# EAGLE design Funkboard_v3 (EAGLE 6.1)
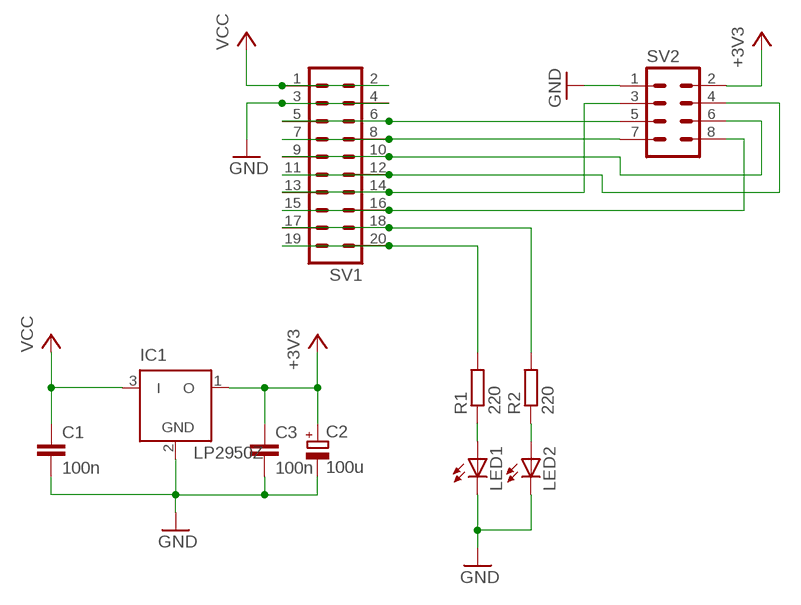
[diagram p0: schematic, sheet 1]

## Parts
C1  100n  C-EU025-025X050  [C025-025X050]
C2  100u  CPOL-EUE2.5-6  [E2,5-6]
C3  100n  C-EU025-025X050  [C025-025X050]
IC1  LP2950Z  [TO92]
LED1  LED3MM  [LED3MM]
LED2  LED3MM  [LED3MM]
R1  220  R-EU_0204/7  [0204/7]
R2  220  R-EU_0204/7  [0204/7]
SV1  MA10-2W  [MA10-2W]
SV2  MA04-2  [MA04-2]

## Nets
+3V3: C2.+ C3.1 IC1.1(O) SV2.2
GND: C1.2 C2.- C3.2 IC1.2(GND) LED1.K(C) LED2.K(C) SV1.3 SV1.4 SV2.1
N$1: LED1.A R1.1
N$2: LED2.A R2.1
N$3: SV1.5 SV1.6 SV2.5
N$4: SV1.7 SV1.8 SV2.7
N$5: SV1.9 SV1.10 SV2.6
N$6: SV1.11 SV1.12 SV2.4
N$7: SV1.13 SV1.14 SV2.3
N$8: SV1.15 SV1.16 SV2.8
N$9: R2.2 SV1.17 SV1.18
N$10: R1.2 SV1.19 SV1.20
VCC: C1.1 IC1.3(I) SV1.1 SV1.2

## Library data of the parts
C1 C3 = rcl:C-EU: CAPACITOR, European symbol
C2 = rcl:CPOL-EU: POLARIZED CAPACITOR, European symbol
IC1 = linear:LP2950: 100 mA, Low Power Low Dropout Voltage Regulator Source: http://www.onsemi.com/pub/Collateral/LP2950-D.PDF
LED1 LED2 = led:LED: LED OSRAM: - CHIPLED LG R971, LG N971, LY N971, LG Q971, LY Q971, LO R971, LY R971 LH N974, LH R974 LS Q976, LO Q976, LY Q976 LO Q996 - Hyper CHIPLED LW Q18S LB Q993, LB Q99A, LB R99A - SideLED LS A670, LO A670, LY A670, LG A670, LP A670 LB A673, LV A673, LT A673, LW A673 LH A674 LY A675 LS A676, LA A676, LO A676, LY A676, LW A676 LS A679, LY A679, LG A679 - Hyper Micro SIDELED® LS Y876, LA Y876, LO Y876, LY Y876 LT Y87S - SmartLED LW L88C, LW L88S LB L89C, LB L89S, LG L890 LS L89K, LO L89K, LY L89K LS L896, LA L896, LO L896, LY L896 - TOPLED LS T670, LO T670, LY T670, LG T670, LP T670 LSG T670, LSP T670, LSY T670, LOP T670, LYG T670 LG T671, LOG T671, LSG T671 LB T673, LV T673, LT T673, LW T673 LH T674 LS T676, LA T676, LO T676, LY T676, LB T676, LH T676, LSB T676, LW T676 LB T67C, LV T67C, LT T67C, LS T67K, LO T67K, LY T67K, LW E67C LS E67B, LA E67B, LO E67B, LY E67B, LB E67C, LV E67C, LT E67C LW T67C LS T679, LY T679, LG T679 LS T770, LO T770, LY T770, LG T770, LP T770 LB T773, LV T773, LT T773, LW T773 LH T774 LS E675, LA E675, LY E675, LS T675 LS T776, LA T776, LO T776, LY T776, LB T776 LHGB T686 LT T68C, LB T68C - Hyper Mini TOPLED® LB M676 - Mini TOPLED Santana® LG M470 LS M47K, LO M47K, LY M47K Source: http://www.osram.convergy.de LUXEON: - LUMILED® LXK2-PW12-R00, LXK2-PW12-S00, LXK2-PW14-U00, LXK2-PW14-V00 LXK2-PM12-R00, LXK2-PM12-S00, LXK2-PM14-U00 LXK2-PE12-Q00, LXK2-PE12-R00, LXK2-PE12-S00, LXK2-PE14-T00, LXK2-PE14-U00 LXK2-PB12-K00, LXK2-PB12-L00, LXK2-PB12-M00, LXK2-PB14-N00, LXK2-PB14-P00, LXK2-PB14-Q00 LXK2-PR12-L00, LXK2-PR12-M00, LXK2-PR14-Q00, LXK2-PR14-R00 LXK2-PD12-Q00, LXK2-PD12-R00, LXK2-PD12-S00 LXK2-PH12-R00, LXK2-PH12-S00 LXK2-PL12-P00, LXK2-PL12-Q00, LXK2-PL12-R00 Source: www.luxeon.com KINGBRIGHT: KA-3528ASYC Source: www.kingbright.com
R1 R2 = rcl:R-EU_: RESISTOR, European symbol
SV1 = con-lstb:MA10-2W: PIN HEADER; OC_FARNELL: unknown; OC_NEWARK: unknown
SV2 = con-lstb:MA04-2: PIN HEADER; OC_FARNELL: unknown; OC_NEWARK: unknown

## Board
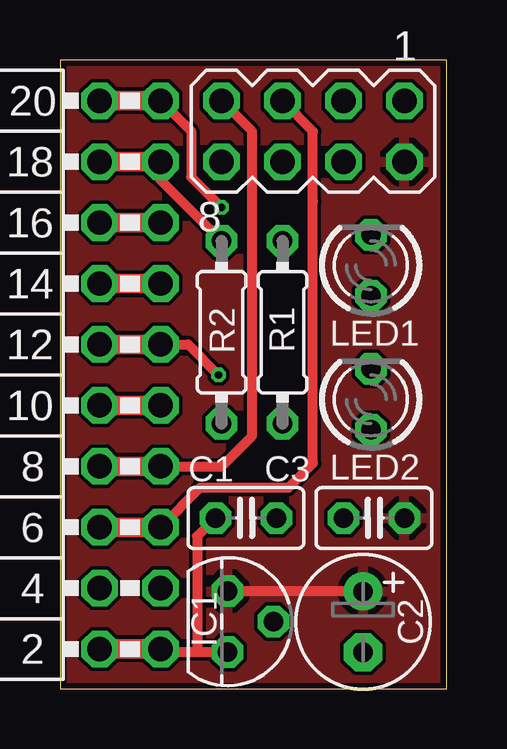
[diagram p1: board, top side]
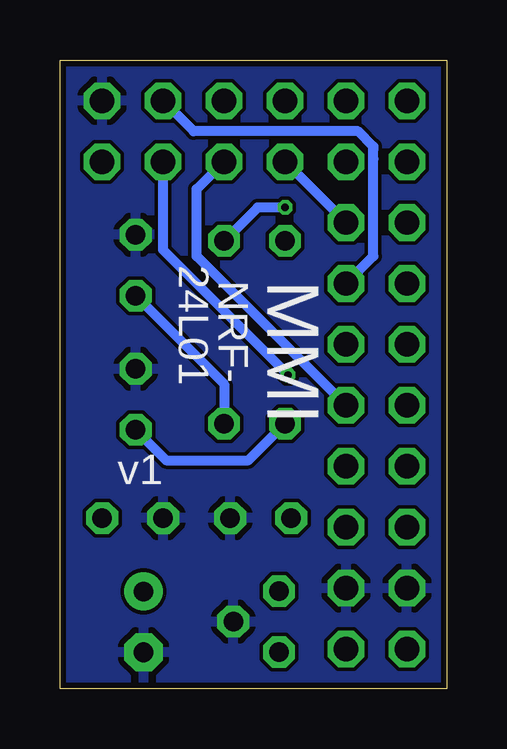
[diagram p2: board, bottom side, seen from below]

Size 16.11 x 26.21 mm. Coordinates in mm from the lower left corner, seen from the top.
Outline: 0,0 16.11,0 16.11,26.21 0,26.21 0,0
Copper layers (1*16): Top 0.035mm / dielectric 1.5mm / Bottom 0.035mm
Design rules: minimum track width 6mil, minimum drill 12mil, track to track 6mil, track to pad 6mil, pad to pad 6mil, via to via 6mil, smd to smd 0mil, copper to edge 10mil, drill to drill 10mil, minimum pad ring 10mil, minimum via ring 6mil, stop-mask expansion 2mil, vias tented up to drill 100mil, thermal gap 10mil

### Footprints (pad centres in the part's own frame; a part is rotated, then mirrored left to right if it is on the bottom)
C025-025X050 = drill 0.813 octagon: 1 -1.27,0; 2 1.27,0
E2,5-6 = drill 0.813 pad 1.6: + -1.27,0 | drill 0.813 pad 1.6 octagon: - 1.27,0
TO92 = drill 0.813 octagon: 1 -1.27,0; 2 0,1.905; 3 1.27,0
LED3MM = drill 0.813 octagon: A -1.27,0; K 1.27,0
0204/7 = drill 0.813 octagon: 1 -3.81,0; 2 3.81,0
MA10-2W = drill 1.016 octagon: 1 -11.43,-1.27; 2 -11.43,1.27; 3 -8.89,-1.27; 4 -8.89,1.27; 5 -6.35,-1.27; 6 -6.35,1.27; 7 -3.81,-1.27; 8 -3.81,1.27; 9 -1.27,-1.27; 10 -1.27,1.27; 11 1.27,-1.27; 12 1.27,1.27; 13 3.81,-1.27; 14 3.81,1.27; 15 6.35,-1.27; 16 6.35,1.27; 17 8.89,-1.27; 18 8.89,1.27; 19 11.43,-1.27; 20 11.43,1.27
MA04-2 = drill 1.016 octagon: 1 -3.81,-1.27; 2 -3.81,1.27; 3 -1.27,-1.27; 4 -1.27,1.27; 5 1.27,-1.27; 6 1.27,1.27; 7 3.81,-1.27; 8 3.81,1.27

### Placement (x,y rotation side)
C1  7.75,7.11 0 top
C2  12.63,2.78 270 top
C3  13.08,7.11 180 top
IC1  6.98,2.79 270 top
LED1  12.95,17.65 90 top
LED2  12.95,12.06 90 top
R1  9.27,14.86 90 top
R2  6.73,14.86 90 top
SV1  2.92,13.08 90 top
SV2  10.54,23.24 180 top

### Tracks (layer width: path | path; a pad name or v marks a point on that pad's centre or on a via)
+3V3
  Top 0.406: C2.+ IC1.1
  pour Top: 0.13,0.13 16,0.13 16,26.04 0.13,26.04
GND
  pour Bottom: 0.13,0.13 16,0.13 16,26.04 0.13,26.04
N$1
  Bottom 0.406: LED1.A 9.27,12.7 R1.1
N$2
  Bottom 0.406: LED2.A 11.68,9.52 8.26,9.52 R2.1
N$3
  Top 0.406: SV1.5 5.84,8.38 9.53,8.38 10.54,9.4 10.54,20.32 10.54,23.24 SV2.5
  Top 0.813: SV1.5 SV1.6
N$4
  Top 0.406: SV1.7 6.73,9.27 8,10.54 8,23.24 SV2.7
  Top 0.813: SV1.7 SV1.8
N$5
  Top 0.813: SV1.9 SV1.10
  Bottom 0.406: SV1.9 9.27,16.89 10.41,18.03 10.41,20.83 SV2.6
N$6  (via drill 0.3)
  Top 0.406: SV1.11 5.33,14.35 v6.6,13.08
  Top 0.813: SV1.11 SV1.12
  Bottom 0.406: v6.6,13.08 11.81,18.29 SV2.4
N$7
  Top 0.813: SV1.14 SV1.13
  Bottom 0.406: SV1.13 3.05,18.03 3.05,22.1 3.05,22.48 3.05,22.61 3.68,23.24 10.54,23.24 SV2.3
N$8
  Top 0.813: SV1.15 SV1.16
  Bottom 0.406: SV1.15 SV2.8
N$9
  Top 0.406: SV1.17 4.19,21.21 R2.2
  Top 0.813: SV1.18 SV1.17
N$10  (via drill 0.3)
  Top 0.406: SV1.19 5.46,23.24 5.46,21.34 v6.73,20.07
  Top 0.813: SV1.19 SV1.20
  Bottom 0.406: v6.73,20.07 7.87,20.07 R1.2
VCC
  Top 0.406: IC1.3 5.71,1.52 | 5.71,1.52 4.32,1.52 SV1.1 | C1.1 5.71,6.35 5.71,1.52
  Top 0.813: SV1.1 SV1.2

### Text on the board
bPlace: 24L01 | MMI | NRF- | v1